# EAGLE design Clock_Updated_3_Nets (EAGLE 7.2.0)
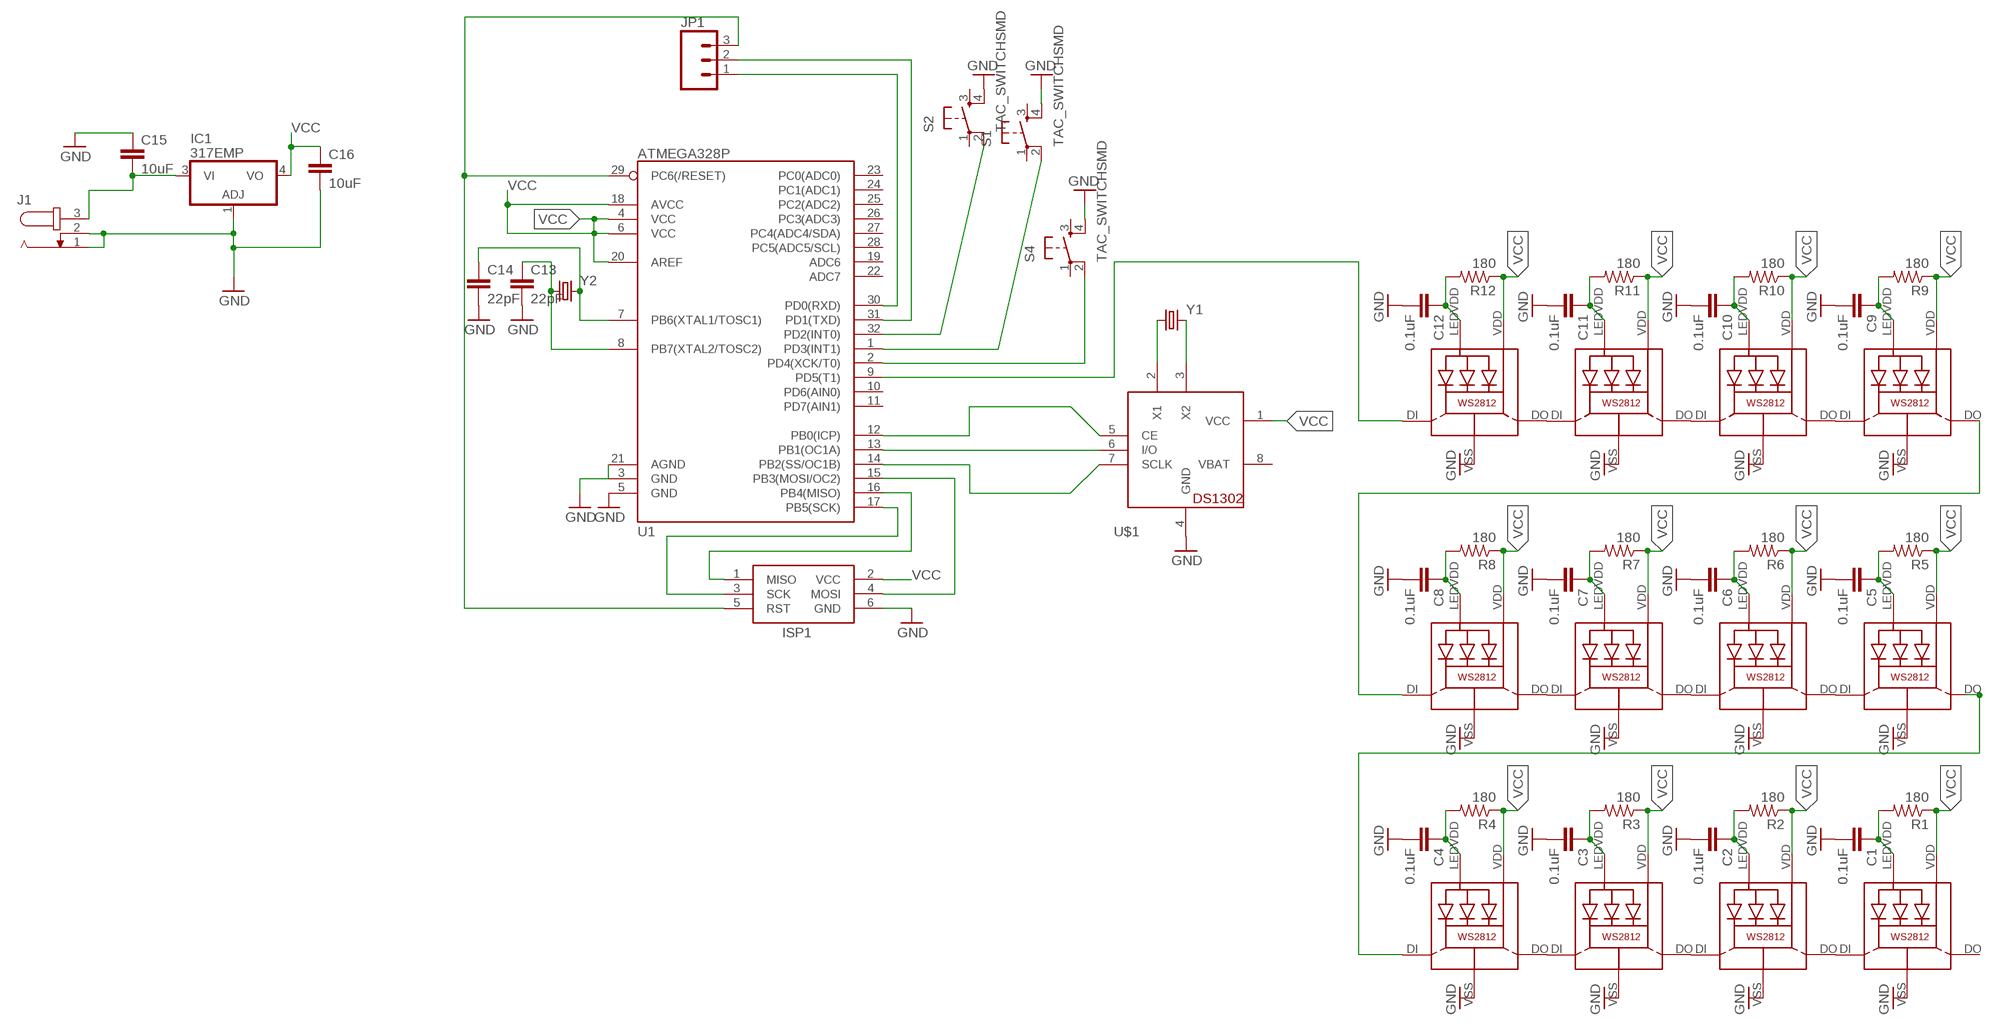
[diagram p0: schematic, sheet 1]

## Parts
C1  0.1uF  0.1UF-25V(+80/-20%)(0603)  [0603-CAP]
C2  0.1uF  0.1UF-25V(+80/-20%)(0603)  [0603-CAP]
C3  0.1uF  0.1UF-25V(+80/-20%)(0603)  [0603-CAP]
C4  0.1uF  0.1UF-25V(+80/-20%)(0603)  [0603-CAP]
C5  0.1uF  0.1UF-25V(+80/-20%)(0603)  [0603-CAP]
C6  0.1uF  0.1UF-25V(+80/-20%)(0603)  [0603-CAP]
C7  0.1uF  0.1UF-25V(+80/-20%)(0603)  [0603-CAP]
C8  0.1uF  0.1UF-25V(+80/-20%)(0603)  [0603-CAP]
C9  0.1uF  0.1UF-25V(+80/-20%)(0603)  [0603-CAP]
C10  0.1uF  0.1UF-25V(+80/-20%)(0603)  [0603-CAP]
C11  0.1uF  0.1UF-25V(+80/-20%)(0603)  [0603-CAP]
C12  0.1uF  0.1UF-25V(+80/-20%)(0603)  [0603-CAP]
C13  22pF  22PF-50V-5%(0603)  [0603-CAP]
C14  22pF  22PF-50V-5%(0603)  [0603-CAP]
C15  10uF  10UF-6.3V-20%(1206)  [1206]
C16  10uF  10UF-6.3V-20%(1206)  [1206]
IC1  317EMP  [SOT223]
ISP1  AVRISP-6  [AVRISP]
J1  JACK-PLUG0  [SPC4077]
JP1  M03PTH  [1X03]
LED1  WS2812  [WS2812]
LED2  WS2812  [WS2812]
LED3  WS2812  [WS2812]
LED4  WS2812  [WS2812]
LED5  WS2812  [WS2812]
LED6  WS2812  [WS2812]
LED7  WS2812  [WS2812]
LED8  WS2812  [WS2812]
LED9  WS2812  [WS2812]
LED10  WS2812  [WS2812]
LED11  WS2812  [WS2812]
LED12  WS2812  [WS2812]
R1  180  180OHM1/10W1%(0603)  [0603-RES]
R2  180  180OHM1/10W1%(0603)  [0603-RES]
R3  180  180OHM1/10W1%(0603)  [0603-RES]
R4  180  180OHM1/10W1%(0603)  [0603-RES]
R5  180  180OHM1/10W1%(0603)  [0603-RES]
R6  180  180OHM1/10W1%(0603)  [0603-RES]
R7  180  180OHM1/10W1%(0603)  [0603-RES]
R8  180  180OHM1/10W1%(0603)  [0603-RES]
R9  180  180OHM1/10W1%(0603)  [0603-RES]
R10  180  180OHM1/10W1%(0603)  [0603-RES]
R11  180  180OHM1/10W1%(0603)  [0603-RES]
R12  180  180OHM1/10W1%(0603)  [0603-RES]
S1  TAC_SWITCHSMD  [TACTILE-SWITCH-SMD]
S2  TAC_SWITCHSMD  [TACTILE-SWITCH-SMD]
S4  TAC_SWITCHSMD  [TACTILE-SWITCH-SMD]
U1  ATMEGA328P  ATMEGA328_SMT  [TQFP32-08]
U$1  DS1302  [DIL08-ROUND]
Y1  CRYSTALTC38H  [TC38H]
Y2  CRYSTALSMD  [HC49UP]

## Nets
GND: C1.2 C2.2 C3.2 C4.2 C5.2 C6.2 C7.2 C8.2 C9.2 C10.2 C11.2 C12.2 C13.2 C14.2 C15.1 C16.2 IC1.1(ADJ) ISP1.6(GND) J1.1 J1.2 LED1.VSS(GND) LED2.VSS(GND) LED3.VSS(GND) LED4.VSS(GND) LED5.VSS(GND) LED6.VSS(GND) LED7.VSS(GND) LED8.VSS(GND) LED9.VSS(GND) LED10.VSS(GND) LED11.VSS(GND) LED12.VSS(GND) S1.4 S2.4 S4.4 U1.3(GND) U1.5(GND) U1.21(AGND) U$1.4(GND)
N$1: ISP1.4(MOSI) U1.15(PB3(MOSI/OC2))
N$2: ISP1.1(MISO) U1.16(PB4(MISO))
N$3: JP1.1 U1.30(PD0(RXD))
N$4: S2.2 U1.32(PD2(INT0))
N$5: U$1.3(X2) Y1.2
N$6: U$1.2(X1) Y1.1
N$7: C1.1 LED1.LEDVDD R1.2
N$8: C2.1 LED2.LEDVDD R2.2
N$9: LED1.DI LED2.DO
N$10: C3.1 LED3.LEDVDD R3.2
N$11: C4.1 LED4.LEDVDD R4.2
N$12: LED3.DI LED4.DO
N$13: C5.1 LED5.LEDVDD R5.2
N$14: C6.1 LED6.LEDVDD R6.2
N$15: LED5.DI LED6.DO
N$16: C7.1 LED7.LEDVDD R7.2
N$17: C8.1 LED8.LEDVDD R8.2
N$18: LED7.DI LED8.DO
N$19: C9.1 LED9.LEDVDD R9.2
N$20: C10.1 LED10.LEDVDD R10.2
N$21: LED9.DI LED10.DO
N$22: C11.1 LED11.LEDVDD R11.2
N$23: C12.1 LED12.LEDVDD R12.2
N$24: LED11.DI LED12.DO
N$25: LED4.DI LED5.DO
N$26: LED8.DI LED9.DO
N$27: JP1.2 U1.31(PD1(TXD))
N$30: S1.2 U1.1(PD3(INT1))
N$31: U1.13(PB1(OC1A)) U$1.6(I/O)
N$32: U1.12(PB0(ICP)) U$1.5(CE)
N$33: U1.14(PB2(SS/OC1B)) U$1.7(SCLK)
N$34: ISP1.3(SCK) U1.17(PB5(SCK))
N$36: ISP1.5(RST) JP1.3 U1.29(PC6(/RESET))
N$37: S4.2 U1.2(PD4(XCK/T0))
N$38: C13.1 U1.8(PB7(XTAL2/TOSC2)) Y2.1
N$40: LED2.DI LED3.DO
N$41: LED6.DI LED7.DO
N$42: LED10.DI LED11.DO
N$43: LED12.DI U1.9(PD5(T1))
N$44: C14.1 U1.7(PB6(XTAL1/TOSC1)) Y2.2
N$45: C15.2 IC1.3(VI) J1.3
VCC: C16.1 IC1.4(VO) ISP1.2(VCC) LED1.VDD LED2.VDD LED3.VDD LED4.VDD LED5.VDD LED6.VDD LED7.VDD LED8.VDD LED9.VDD LED10.VDD LED11.VDD LED12.VDD R1.1 R2.1 R3.1 R4.1 R5.1 R6.1 R7.1 R8.1 R9.1 R10.1 R11.1 R12.1 U1.4(VCC) U1.6(VCC) U1.18(AVCC) U1.20(AREF) U$1.1(VCC)
Unconnected: LED1.DO S1.1 S1.3 S2.1 S2.3 S4.1 S4.3 U1.10(PD6(AIN0)) U1.11(PD7(AIN1)) U1.19(ADC6) U1.22(ADC7) U1.23(PC0(ADC0)) U1.24(PC1(ADC1)) U1.25(PC2(ADC2)) U1.26(PC3(ADC3)) U1.27(PC4(ADC4/SDA)) U1.28(PC5(ADC5/SCL))

## Power pins joined to a net without a drawn wire
VBAT: U$1.8(VBAT)

## Library data of the parts
C1-C12 = SparkFun-Capacitors:0.1UF-25V(+80/-20%)(0603): CAP-00810 Ceramic Standard decoupling cap; PROD_ID: CAP-00810
C13 C14 = SparkFun-Capacitors:22PF-50V-5%(0603): CAP-07876; PROD_ID: CAP-07876
C15 C16 = SparkFun-Capacitors:10UF-6.3V-20%(1206): CAP-10057 Ceramic; PROD_ID: CAP-10057
IC1 = linear:*317: Positive VOLTAGE REGULATOR
ISP1 = adafruit:AVRISP: AVR ISP HEADER Standard 6 pin header for AVR programming
J1 = con-jack:JACK-PLUG: DC POWER JACK Power Jack, DC, Right Angle, Through Hole, Rated 5A at 16VDC, PC Terminals Distributor: Farnell (www.Farnell.de) Drawing: 84N1161.pdf / 84N1162.pdf Manufacturer: SPC Technology (www.spctechnology.com) Type: SPC4077 / SPC 4078; OC_FARNELL: unknown; OC_NEWARK: unknown
JP1 = SparkFun-Connectors:M03: Header 3 Standard 3-pin 0.1" header. Use with straight break away headers (SKU : PRT-00116), right angle break away headers (PRT-00553), swiss pins (PRT-00743), machine pins (PRT-00117), and female headers (PRT-00115). Molex polarized connector foot print use with SKU : PRT-08232 with associated crimp pins and housings.
LED1-LED12 = adafruit:WS2812
R1-R12 = SparkFun-Resistors:180OHM1/10W1%(0603): RES-08788; PROD_ID: RES-08788
S1 S2 S4 = SparkFun-Electromechanical:TAC_SWITCH: Momentary Switch Button commonly used for reset or general input. Spark Fun Electronics SKU : COM-00097 SMT- SWCH-08247; PROD_ID: SWCH-08247
U1 = SparkFun-DigitalIC:ATMEGA328_SMT: 32-Pin Atmega328 part Commonly used on Arduino compatible boards Available in QFP and QFN packages TQFP is IC-09069 QFN is non-stock; PROD_ID: IC-09069
U$1 = adafruit:DS1302: DS1302 - Real time clock with supercap trickle charger
Y1 Y2 = SparkFun-FreqCtrl:CRYSTAL: Various standard crystals. Proven footprints. Spark Fun Electronics SKU : COM-00534

## Board
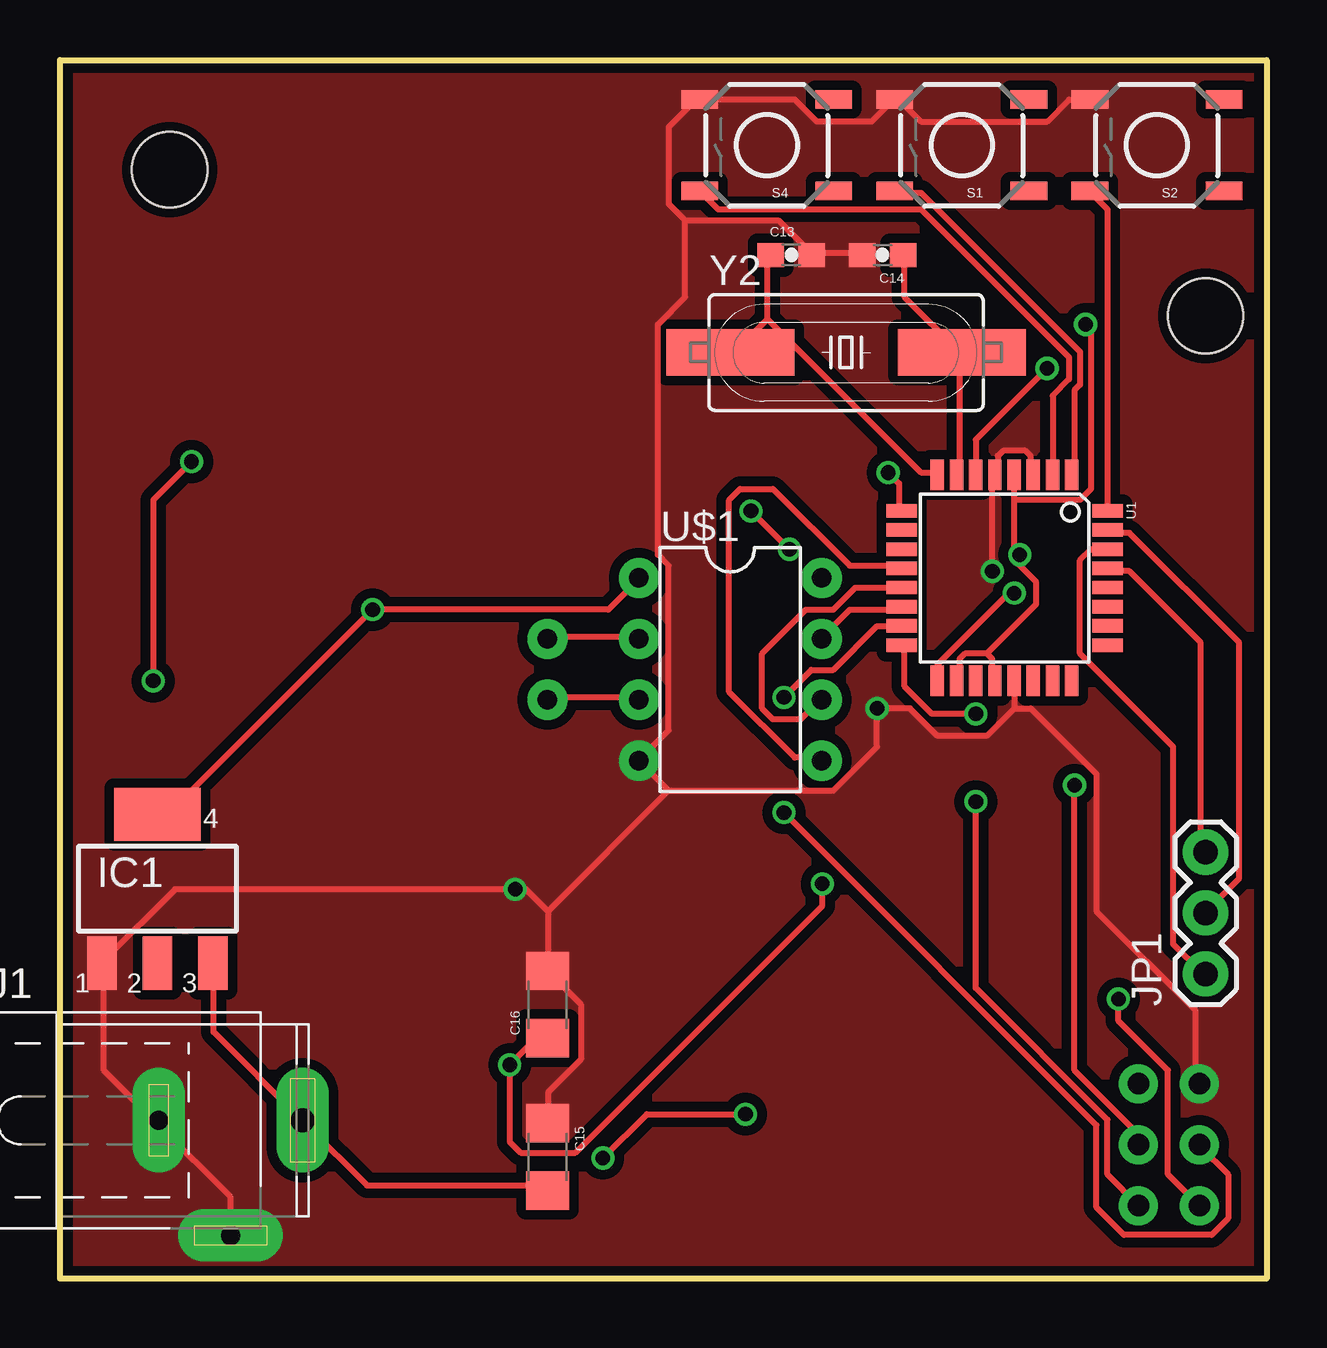
[diagram p1: board, top side]
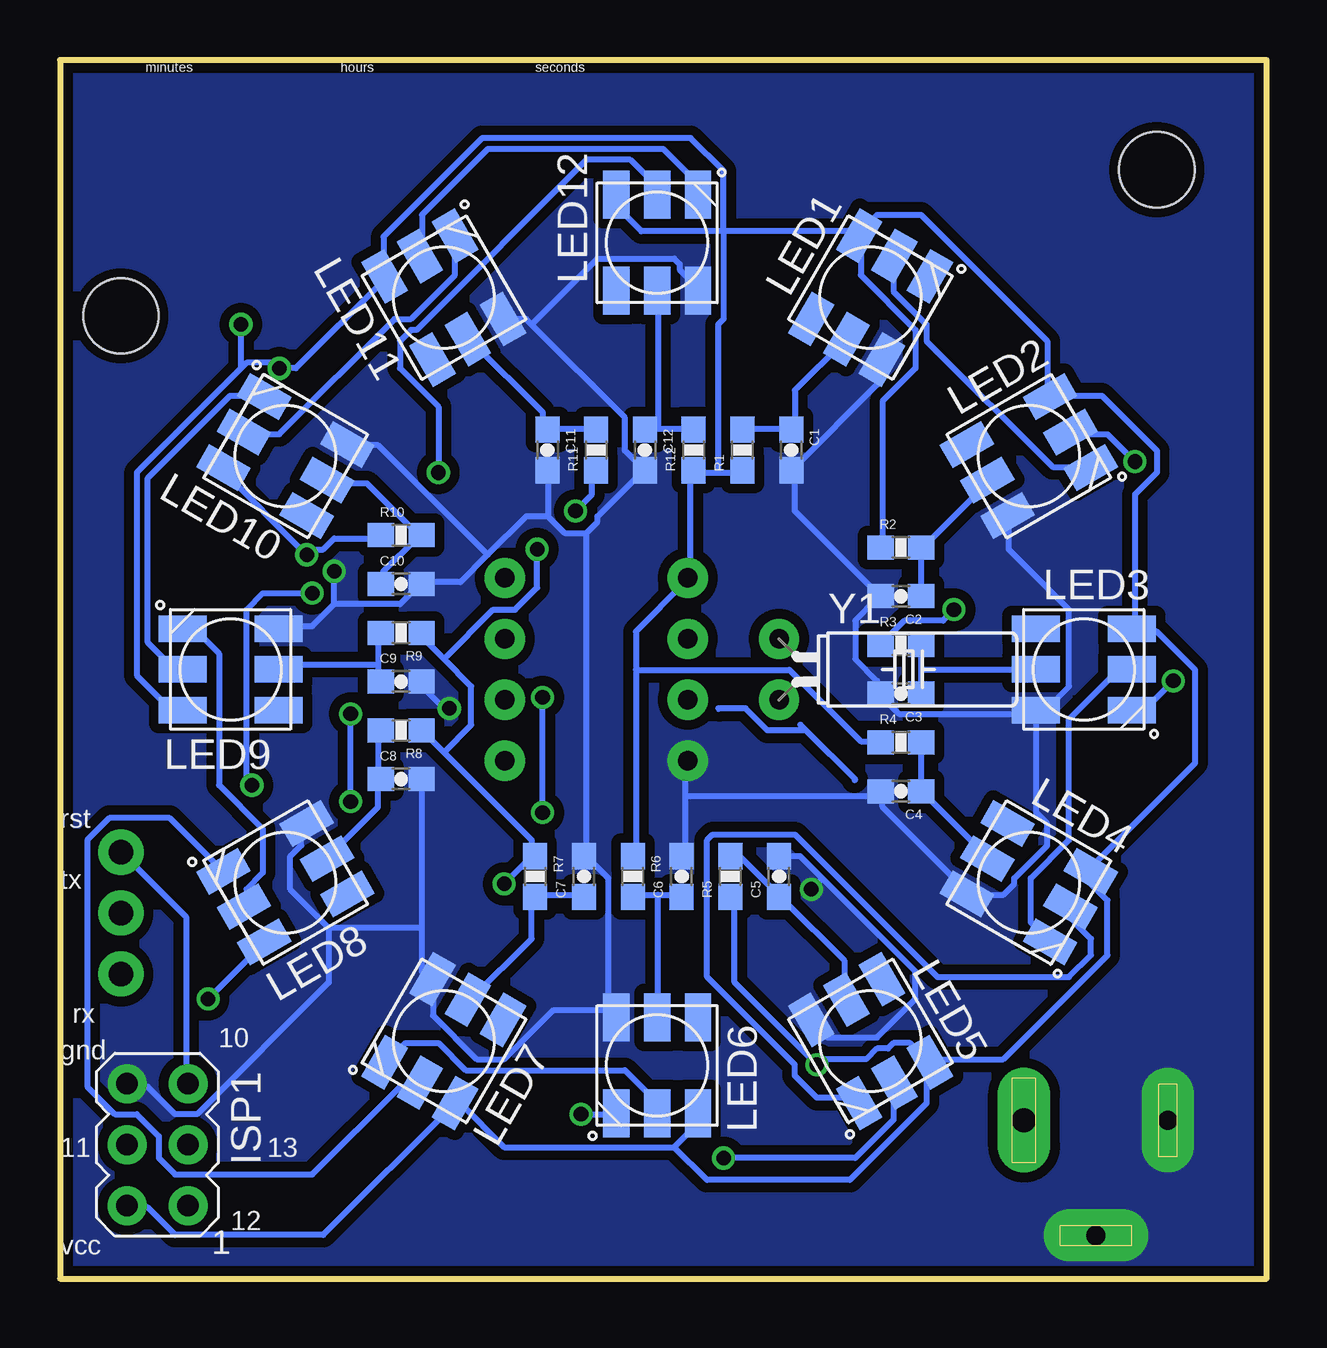
[diagram p2: board, bottom side, seen from below]

Size 50.29 x 50.8 mm. Coordinates in mm from the lower left corner, seen from the top.
Outline: 0,0 0,50.8 50.29,50.8 50.29,0 0,0
Copper layers (1*16): Top 0.0356mm / dielectric 1.5011mm / Bottom 0.0356mm
Design rules "patrick": minimum track width 6mil, minimum drill 13mil, track to track 6mil, track to pad 6mil, pad to pad 6mil, via to via 6mil, smd to smd 6mil, copper to edge 15mil, drill to drill 6mil, minimum pad ring 7mil, minimum via ring 7mil, stop-mask expansion 3mil, vias tented up to drill 30mil, thermal gap 10mil
Holes 3.14 mm at 4.57,46.23 47.75,40.13

### Footprints (pad centres in the part's own frame; a part is rotated, then mirrored left to right if it is on the bottom)
0603-CAP = smd 1.1 x 1: 1 -0.85,0; 2 0.85,0
1206 = smd 1.6 x 1.8: 1 -1.4,0; 2 1.4,0
SOT223 = smd 1.219 x 2.235: 1 -2.311,-3.099; 2 0,-3.099; 3 2.311,-3.099 | smd 3.6 x 2.2: 4 0,3.099
AVRISP = drill 0.9 pad 1.626: 1 -1.27,2.54; 2 1.27,2.54; 3 -1.27,0; 4 1.27,0; 5 -1.27,-2.54; 6 1.27,-2.54
SPC4077 = drill 0.8 pad 2.184 long: 1 -3,0; 2 0,-4.8 | drill 1 pad 2.184 long: 3 3,0
1X03 = drill 1.016 pad 1.88: 1 0,0; 2 2.54,0; 3 5.08,0
WS2812 = smd 2 x 1.1: DI 2,0; DO 2,-1.7; LEDVDD -2,0; NC -2,1.7; VDD 2,1.7; VSS -2,-1.7
0603-RES = smd 1.1 x 1: 1 -0.85,0; 2 0.85,0
TACTILE-SWITCH-SMD = smd 1.524 x 0.762: 1 -2.794,1.905; 2 2.794,1.905; 3 -2.794,-1.905; 4 2.794,-1.905
TQFP32-08 = smd 1.27 x 0.559: 1 -4.293,2.8; 2 -4.293,2; 3 -4.293,1.2; 4 -4.293,0.4; 5 -4.293,-0.4; 6 -4.293,-1.2; 7 -4.293,-2; 8 -4.293,-2.8; 17 4.293,-2.8; 18 4.293,-2; 19 4.293,-1.2; 20 4.293,-0.4; 21 4.293,0.4; 22 4.293,1.2; 23 4.293,2; 24 4.293,2.8 | smd 0.559 x 1.27: 9 -2.8,-4.293; 10 -2,-4.293; 11 -1.2,-4.293; 12 -0.4,-4.293; 13 0.4,-4.293; 14 1.2,-4.293; 15 2,-4.293; 16 2.8,-4.293; 25 2.8,4.293; 26 2,4.293; 27 1.2,4.293; 28 0.4,4.293; 29 -0.4,4.293; 30 -1.2,4.293; 31 -2,4.293; 32 -2.8,4.293
DIL08-ROUND = drill 0.813 pad 1.676: 1 -3.81,-3.81; 2 -1.27,-3.81; 3 1.27,-3.81; 4 3.81,-3.81; 5 3.81,3.81; 6 1.27,3.81; 7 -1.27,3.81; 8 -3.81,3.81
TC38H = drill 0.813 pad 1.676: 1 -1.27,0; 2 1.27,0
HC49UP = smd 5.334 x 1.93: 1 -4.826,0; 2 4.826,0

### Placement (x,y rotation side)
C1  19.81,34.54 270 bottom
C2  15.24,28.45 180 bottom
C3  15.24,24.38 180 bottom
C4  15.24,20.32 180 bottom
C5  20.32,16.76 90 bottom
C6  24.38,16.76 90 bottom
C7  28.45,16.76 90 bottom
C8  36.07,20.83 0 bottom
C9  36.07,24.89 0 bottom
C10  36.07,28.96 0 bottom
C11  29.97,34.54 270 bottom
C12  25.91,34.54 270 bottom
C13  30.48,42.67 0 top
C14  34.29,42.67 180 top
C15  20.32,5.08 270 top
C16  20.32,11.43 90 top
IC1  4.06,16.26 0 top
ISP1  46.23,5.59 180 bottom
J1  7.11,6.6 0 top
JP1  47.75,12.7 90 top
LED1  16.51,40.89 60 bottom
LED2  9.91,34.29 30 bottom
LED3  7.62,25.4 0 bottom
LED4  9.91,16.51 330 bottom
LED5  16.51,9.91 300 bottom
LED6  25.4,8.89 270 bottom
LED7  34.29,9.91 240 bottom
LED8  40.89,16.51 210 bottom
LED9  43.18,25.4 180 bottom
LED10  40.89,34.29 150 bottom
LED11  34.29,40.89 120 bottom
LED12  25.4,43.18 90 bottom
R1  21.84,34.54 90 bottom
R2  15.24,30.48 0 bottom
R3  15.24,26.42 0 bottom
R4  15.24,22.35 0 bottom
R5  22.35,16.76 90 bottom
R6  26.42,16.76 270 bottom
R7  30.48,16.76 270 bottom
R8  36.07,22.86 180 bottom
R9  36.07,26.92 180 bottom
R10  36.07,30.99 0 bottom
R11  27.94,34.54 90 bottom
R12  23.88,34.54 90 bottom
S1  37.59,47.24 180 top
S2  45.72,47.24 180 top
S4  29.46,47.24 180 top
U1  39.37,29.21 270 top
U$1  27.94,25.4 270 top
Y1  20.32,25.4 270 bottom
Y2  32.77,38.61 0 top

### Tracks (layer width: path | path; a pad name or v marks a point on that pad's centre or on a via)
GND  (via drill 0.61)
  Top 0.254: U1.3 40.46,33.6 40.46,34.29 40.23,34.52 39.32,34.52 39.09,34.29 39.09,33.6 U1.5 38.86,33.38 v38.86,29.49 | C14.2 33.38,42.75 31.55,42.75 C13.2 31.32,42.75 29.95,44.12 26.06,44.12 | S2.4 42.06,49.15 41.15,48.23 35.89,48.23 34.98,49.15 S1.4 34.75,49.15 33.83,48.23 31.55,48.23 30.63,49.15 S4.4 26.52,49.15 25.38,48.01 25.38,44.81 26.06,44.12 | J1.2 7.09,1.83 7.09,3.43 4.12,6.4 J1.1 3.89,6.63 1.83,8.69 1.83,13.03 IC1.1 1.83,13.26 4.8,16.23 v18.97,16.23 19.43,16.23 20.34,15.32 | C15.1 20.34,6.63 20.34,7.77 21.72,9.14 21.72,11.43 20.34,12.8 C16.2 20.34,13.03 20.34,15.32 | 39.78,23.77 38.63,22.63 36.58,22.63 35.43,23.77 v34.06,23.77 34.06,22.17 32.23,20.34 25.38,20.34 | 39.78,23.77 U1.21 | 25.38,20.34 U$1.4 24.23,21.72 25.38,22.86 25.38,29.72 24.92,30.18 24.92,39.78 26.06,40.92 26.06,44.12 | 25.38,20.34 20.34,15.32 | 39.78,23.77 40.46,23.77 43.2,21.03 43.2,15.32 47.32,11.2 47.32,8.23 ISP1.6
  Bottom 0.254: 38.86,28.12 v38.86,29.49 | 38.86,28.12 39.78,27.2 41.15,27.2 LED9.VSS | 28.35,31.09 27.89,31.55 27.89,31.77 26.06,33.6 C12.2 26.06,33.83 26.75,34.52 26.75,35.89 30.63,39.78 | 28.35,31.09 29.26,31.09 29.95,31.77 | 29.95,31.77 29.95,33.6 C11.2 | 32.46,30.18 30.86,31.77 29.95,31.77 | 32.46,30.18 33.6,29.03 35.2,29.03 C10.2 35.43,28.8 36.12,28.12 38.86,28.12 | 32.46,30.18 37.03,34.75 38.18,34.75 LED10.VSS | 30.63,39.78 30.86,40.01 31.77,40.01 LED11.VSS | 30.63,39.78 27.89,42.52 24.69,42.52 24.46,42.29 24.46,42.06 23.77,41.38 LED12.VSS | 27.43,11.2 27.43,16.69 28.35,17.6 C7.2 28.35,17.83 28.35,31.09 | 27.43,11.2 27.2,10.97 LED6.VSS 27.43,11.2 | 35.2,14.63 35.2,12.8 34.98,12.57 LED7.VSS 34.75,12.34 34.75,10.97 32.92,9.14 31.77,9.14 29.72,11.2 27.43,11.2 | 35.2,14.63 35.2,20.8 C8.2 | 39.09,14.63 40.69,16.23 40.69,17.6 40.23,18.06 40.23,18.97 LED8.VSS | 35.2,14.63 39.09,14.63 | 39.09,14.63 39.09,12.34 44.58,6.86 45.49,6.86 46.63,8 47.32,8 ISP1.6 | LED1.VSS 16.23,38.18 16.23,37.26 19.66,33.83 C1.2 19.66,33.6 19.66,32 16.23,28.57 C2.2 16.23,28.35 17.14,27.43 17.14,25.83 16.23,24.92 16.23,24.46 C3.2 16,24.23 15.32,23.55 9.83,23.55 LED3.VSS | LED2.VSS 10.74,31.77 10.74,30.4 8.23,27.89 8.23,24.69 9.14,23.77 9.6,23.77 LED3.VSS | 18.52,16.69 14.63,12.8 14.63,11.66 16.23,10.06 18.29,10.06 18.97,10.74 LED5.VSS | 18.52,16.69 19.43,17.6 20.12,17.6 C5.2 | v34.06,23.77 34.29,23.77 35.2,24.69 C9.2 | 24.23,20.12 24.23,21.49 U$1.4 | 24.23,20.12 24.23,17.83 C6.2 | 24.23,20.12 16.23,20.12 C4.2 16,20.12 16,19.66 12.57,16.23 LED4.VSS 12.34,16 10.97,16 10.52,16.46 10.52,16.69 9.14,18.06 9.14,18.97 9.6,19.43 9.6,23.55 LED3.VSS
  Bottom 0.254: v18.97,16.23 18.52,16.69
  pour Bottom (isolate 0.406, no thermals): 0,50.8 0,0 50.29,0 50.29,50.8
  pour Top (isolate 0.406, no thermals): 0,50.8 0,0 50.29,0 50.29,50.8
N$1  (via drill 0.61)
  Top 0.254: v30.18,24.23 31.32,25.38 32.23,25.38 34.06,27.2 34.98,27.2 U1.15 | v30.18,19.43 43.2,6.4 43.2,2.97 44.35,1.83 48.01,1.83 48.69,2.52 48.69,4.34 47.55,5.49 ISP1.4
  Bottom 0.254: v30.18,19.43 v30.18,24.23
N$2  (via drill 0.61)
  Top 0.254: v38.18,23.55 36.35,23.55 35.2,24.69 35.2,26.29 U1.16 | v38.18,19.89 38.18,12.12 43.66,6.63 43.66,4.34 ISP1.1
  Bottom 0.254: v38.18,19.89 v38.18,23.55
N$3
  Top 0.254: U1.30 42.98,30.4 42.52,29.95 42.52,26.06 46.41,22.17 46.41,13.95 47.55,12.8 JP1.1
N$4
  Top 0.254: U1.32 43.66,44.58 42.98,45.26 S2.2
N$5
  Top 0.254: Y1.2 20.34,24.23 24,24.23 U$1.3
N$6
  Top 0.254: Y1.1 20.34,26.75 24,26.75 U$1.2
N$7
  Bottom 0.254: R1.2 21.72,35.43 19.89,35.43 C1.1 19.66,35.43 19.66,37.03 17.6,39.09 LED1.LEDVDD
N$8
  Bottom 0.254: C2.1 14.4,28.57 14.4,30.4 R2.2 14.17,30.63 11.66,33.15 LED2.LEDVDD
N$9
  Bottom 0.254: LED2.DO 7.54,33.83 8.91,33.83 14.17,39.09 14.17,39.78 15.54,41.15 15.54,42.52 LED1.DI
N$10
  Bottom 0.254: 14.4,25.38 14.4,26.29 R3.2 | 14.4,25.38 14.4,24.46 C3.1 | 14.4,25.38 9.83,25.38 LED3.LEDVDD
N$11
  Bottom 0.254: R4.2 14.4,22.17 14.4,20.34 C4.1 14.17,20.12 11.66,17.6 LED4.LEDVDD
N$12
  Bottom 0.254: LED3.DI 5.71,25.38 6.17,25.38 8.23,23.32 8.23,18.29 9.83,16.69 9.83,14.86 9.14,14.17 LED4.DO
N$13
  Bottom 0.254: R5.2 22.17,17.83 20.34,16 C5.1 20.12,15.77 17.6,13.26 17.6,11.66 LED5.LEDVDD
N$14
  Bottom 0.254: 25.38,16 26.29,16 R6.2 | 25.38,16 24.46,16 C6.1 | 25.38,16 25.38,10.97 LED6.LEDVDD
N$15  (via drill 0.61)
  Top 0.254: v28.57,6.86 24.46,6.86 v22.63,5.03
  Bottom 0.254: v28.57,6.86 27.2,6.86 LED6.DO | v22.63,5.03 17.14,5.03 15.54,6.63 15.54,8 LED5.DI
N$16
  Bottom 0.254: C7.1 28.57,16 30.4,16 R7.2 30.63,15.77 30.63,14.17 33.15,11.66 LED7.LEDVDD
N$17
  Bottom 0.254: R8.2 37.03,22.86 37.03,21.03 C8.1 37.03,20.8 37.03,19.66 39.09,17.6 LED8.LEDVDD
N$18
  Bottom 0.254: LED7.DI 35.43,8 36.12,8 39.78,4.34 45.49,4.34 46.18,5.03 46.18,5.94 47.09,6.86 48.01,6.86 49.15,8 49.15,18.29 48.23,19.2 45.72,19.2 43.66,17.14 LED8.DO
N$19
  Bottom 0.254: 37.03,25.6 37.03,26.75 R9.2 | 37.03,25.6 37.03,24.92 C9.1 | 37.03,25.6 41.15,25.6 LED9.LEDVDD
N$20
  Bottom 0.254: C10.1 36.8,29.03 36.8,29.49 35.43,30.86 R10.2 35.43,31.09 37.49,33.15 39.09,33.15 LED10.LEDVDD
N$21
  Bottom 0.254: LED10.DO 41.83,36.8 43.2,36.8 46.63,33.38 46.63,26.52 45.72,25.6 45.26,25.6 LED9.DI
N$22
  Bottom 0.254: R11.2 28.12,35.43 29.95,35.43 C11.1 30.18,35.43 30.18,36.12 33.15,39.09 LED11.LEDVDD
N$23
  Bottom 0.254: 25.38,35.43 25.83,35.43 C12.1 | 25.38,35.43 24,35.43 R12.2 | 25.38,35.43 25.38,41.15 LED12.LEDVDD
N$24
  Bottom 0.254: LED11.DI 35.2,42.75 35.2,44.35 32.46,47.09 25.15,47.09 23.77,45.72 23.77,45.26 LED12.DO
N$25
  Bottom 0.254: LED4.DI 8,15.32 8,14.86 7.32,14.17 7.32,13.49 8.23,12.57 13.72,12.57 19.66,18.52 23.09,18.52 23.32,18.29 23.32,12.57 19.66,8.91 19.66,8.46 18.75,7.54 17.14,7.54 LED5.DO
N$26
  Bottom 0.254: LED8.DI 42.52,15.54 42.52,16.23 41.83,16.92 41.83,18.75 43.66,20.57 43.66,26.06 44.58,26.98 45.03,26.98 LED9.DO
N$27
  Top 0.254: U1.31 43.66,31.09 44.58,31.09 49.15,26.52 49.15,16.69 47.78,15.32 JP1.2
N$28
  Bottom 0.254: 22.8,23.75 22.86,23.77 21.72,23.77 20.8,22.86 19.2,22.86 | 17.17,20.78 17.14,20.8 19.2,22.86 | 19.43,23.09 19.43,23.08 19.2,22.86
N$30
  Top 0.254: U1.1 42.29,33.6 42.29,37.03 42.52,37.26 42.52,38.63 35.89,45.26 34.98,45.26 S1.2
N$31
  Top 0.254: U1.13 34.98,28.8 33.15,28.8 32.23,27.89 31.09,27.89 29.26,26.06 29.26,23.77 29.72,23.32 30.86,23.32 31.55,24 U$1.6
N$32
  Top 0.254: U1.12 34.98,29.72 32.92,29.72 29.72,32.92 28.35,32.92 27.89,32.46 27.89,24.46 30.63,21.72 31.55,21.72 U$1.5
N$33
  Top 0.254: U1.14 34.98,27.89 32.92,27.89 31.77,26.75 U$1.7
N$34  (via drill 0.61)
  Top 0.254: v39.78,28.57 39.55,28.57 36.58,25.6 U1.17 | v42.29,20.57 42.29,8.69 44.81,6.17 44.81,5.71 ISP1.3
  Bottom 0.254: v39.78,28.57 41.83,28.57 42.52,27.89 42.52,20.8 v42.29,20.57
N$36
  Top 0.254: U1.29 43.66,29.49 44.58,29.49 47.55,26.52 47.55,17.83 JP1.3
  Bottom 0.254: ISP1.5 45.03,8.23 45.03,15.09 47.55,17.6 JP1.3
N$37
  Top 0.254: S4.2 27.43,44.58 35.89,44.58 42.06,38.41 42.06,37.49 41.38,36.8 41.38,33.6 U1.2
N$38
  Top 0.254: 29.49,40.01 29.49,42.52 C13.1 | 29.49,40.01 28.12,38.63 Y2.1 | 29.49,40.01 35.89,33.6 36.35,33.6 U1.8
N$40  (via drill 0.61)
  Top 0.254: v3.89,24.92 3.89,32.46 v5.49,34.06
  Bottom 0.254: v3.89,24.92 5.03,23.77 5.49,23.77 LED3.DO | v5.49,34.06 6.63,35.2 8,35.2 LED2.DI
N$41
  Bottom 0.254: LED6.DI 25.6,7.09 25.6,7.54 26.75,8.69 33.38,8.69 34.52,9.83 35.89,9.83 36.58,9.14 LED7.DO
N$42
  Bottom 0.254: LED11.DO 33.83,43.43 33.83,41.83 35.66,40.01 36.35,40.01 41.15,35.2 42.52,35.2 LED10.DI
N$43  (via drill 0.61)
  Top 0.254: v34.52,33.6 34.98,33.15 34.98,32.23 U1.9
  Bottom 0.254: v34.52,33.6 34.52,36.35 36.12,37.95 36.12,39.09 35.66,39.55 35.43,39.55 28.35,46.63 26.52,46.63 25.6,45.72 25.6,45.26 LED12.DI
N$44
  Top 0.254: C14.1 35.2,42.52 35.2,40.92 37.49,38.63 Y2.2 37.49,38.41 37.49,33.6 U1.7
N$45
  Top 0.254: C15.2 20.12,3.89 12.8,3.89 10.29,6.4 J1.3 10.06,6.63 6.4,10.29 6.4,13.03 IC1.3
VCC  (via drill 0.61)
  Top 0.254: U$1.1 24,29.03 22.86,27.89 v13.03,27.89 4.57,19.43 4.12,19.43 IC1.4 | 38.63,26.06 37.72,26.06 37.49,25.83 37.49,24.92 U1.18 | 38.63,26.06 38.86,25.83 38.86,24.92 U1.20 | 39.78,30.18 39.78,29.95 40.69,29.03 40.69,28.12 38.63,26.06 | 39.78,30.18 39.78,32.46 | 39.78,32.46 39.78,33.38 U1.4 | 39.78,30.18 v40.01,30.18 | v41.15,37.95 38.18,34.98 38.18,33.6 U1.6 | 39.78,32.46 42.52,32.46 42.98,32.92 42.98,39.55 v42.75,39.78 | v30.4,30.4 v28.8,32 | v44.12,11.66 44.12,10.74 46.18,8.69 46.18,4.34 47.32,3.2 ISP1.2 | C16.1 20.12,9.83 19.66,9.83 v18.75,8.91 18.75,5.71 19.2,5.26 21.49,5.26 31.77,15.54 v31.77,16.46
  Bottom 0.254: 22.86,33.6 23.77,33.6 R12.1 24,33.6 24,29.26 U$1.1 24.23,29.03 26.29,26.98 26.29,25.38 | 22.86,33.6 21.95,33.6 R1.1 | 26.29,25.38 26.29,17.83 R6.1 | 26.29,25.38 19.89,25.38 16.92,22.4 16.23,22.4 R4.1 | v13.03,27.89 13.49,27.43 15.09,27.43 16,26.52 R3.1 | 40.01,30.4 40.23,30.4 43.43,33.6 LED10.VDD | 40.01,30.4 39.32,30.4 38.86,30.86 37.03,30.86 R10.1 | v40.01,30.18 40.01,30.4 | 42.75,37.95 42.52,38.18 41.38,38.18 v41.15,37.95 40.46,37.95 36.8,41.6 LED11.VDD 36.8,41.83 36.8,43.43 32.69,47.55 24,47.55 22.63,46.18 22.63,43.66 | 42.75,37.95 47.09,33.6 47.09,25.15 45.72,23.77 45.26,23.77 LED9.VDD | 42.75,37.95 v42.75,39.78 | R2.1 16,30.63 16,36.58 14.63,37.95 14.63,39.55 16.92,41.83 16.92,43.43 LED1.VDD | 22.63,43.66 17.14,43.66 LED1.VDD | 22.63,43.66 26.06,43.66 26.98,44.58 26.98,45.03 LED12.VDD | LED1.VDD 16.92,43.66 16.23,44.35 14.4,44.35 9.14,39.09 9.14,36.8 LED2.VDD 8.91,36.8 6.86,36.8 4.57,34.52 4.57,33.6 5.49,32.69 5.49,27.2 LED3.VDD 5.49,26.98 4.57,26.98 2.97,25.38 2.97,21.49 7.32,17.14 LED4.VDD 7.32,16.92 7.32,16.46 6.63,15.77 6.63,13.49 10.97,9.14 13.95,9.14 LED5.VDD | 22.86,33.6 22.86,39.78 22.63,40.01 22.63,43.66 | 34.29,21.95 35.2,22.86 R8.1 | 34.29,21.95 30.63,18.29 30.63,17.83 R7.1 30.63,17.6 v31.77,16.46 | 34.29,25.83 33.15,24.69 33.15,23.09 34.29,21.95 | 34.29,25.83 35.2,26.75 R9.1 | v28.8,32 28.12,32.69 28.12,33.6 R11.1 | v30.4,30.4 30.4,28.8 31.32,27.89 32.23,27.89 34.29,25.83 | v44.12,11.66 41.83,13.95 LED8.VDD | 24.69,5.49 23.77,6.4 23.77,6.86 LED6.VDD | 24.69,5.49 31.77,5.49 33.6,7.32 LED7.VDD 33.83,7.32 39.32,1.83 45.49,1.83 46.63,2.97 47.32,2.97 ISP1.2
  Bottom 0.254: 18.75,9.14 16.69,9.14 16.23,9.6 15.77,9.6 15.54,9.83 14.86,9.83 14.17,9.14 LED5.VDD | 18.75,9.14 18.97,9.14 22.17,12.34 22.17,15.77 R5.1 | 18.75,9.14 v18.75,8.91 | 24.69,5.49 23.32,4.12 17.37,4.12 14.17,7.32 14.17,8.91 LED5.VDD

### Text on the board
bPlace: seconds | hours | minutes
bNames: rst | tx | rx | 10 | gnd | 13 | 11 | 12 | vcc